# Altium schematic sheet Sheet2.SchDoc
size A4
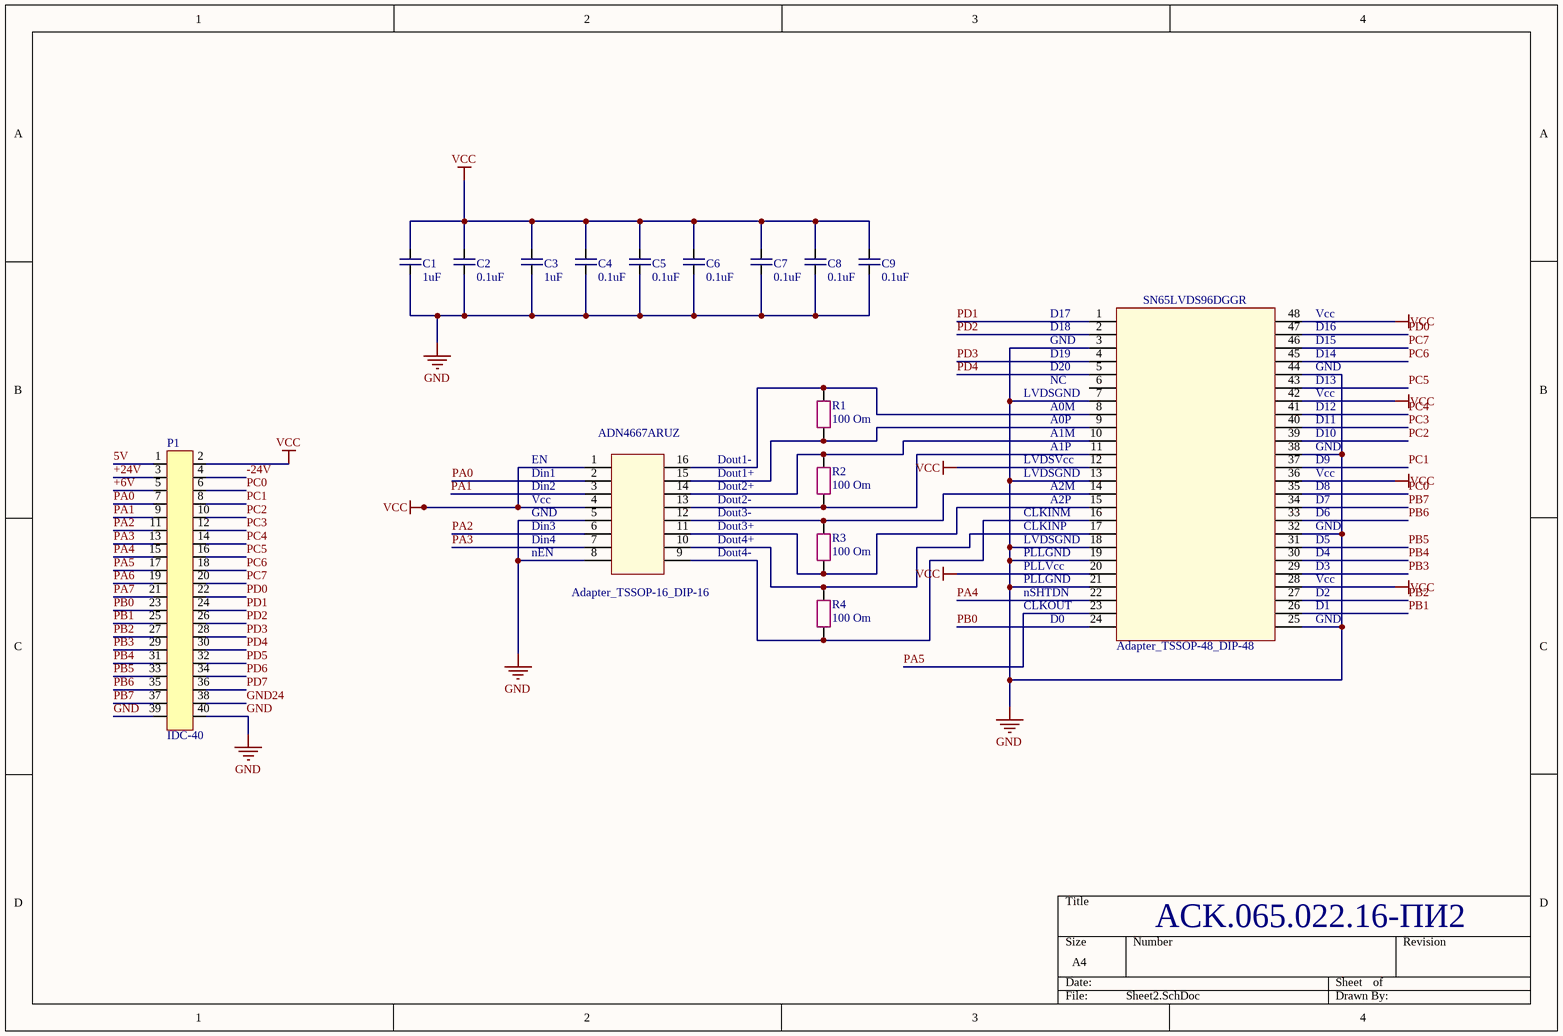
[diagram p0: Sheet2.SchDoc]

## Parts
ADN4667ARUZ  Adapter_TSSOP-16_DIP-16  [Adapter_TSSOP-16_DIP-16]
C1  1uF  [C_0805]
C2  0.1uF  [C_0805]
C3  1uF  [C_0805]
C4  0.1uF  [C_0805]
C5  0.1uF  [C_0805]
C6  0.1uF  [C_0805]
C7  0.1uF  [C_0805]
C8  0.1uF  [C_0805]
C9  0.1uF  [C_0805]
P1  IDC-40  [IDC-40]
R1  100 Om  [R_0805]
R2  100 Om  [R_0805]
R3  100 Om  [R_0805]
R4  100 Om  [R_0805]
SN65LVDS96DGGR  Adapter_TSSOP-48_DIP-48  [Adapter_TSSOP-48_DIP-48]

## Nets
GND: ADN4667ARUZ.5 ADN4667ARUZ.8 C1.2 C2.2 C3.2 C4.2 C5.2 C6.2 C7.2 C8.2 C9.2 P1.39 P1.40 SN65LVDS96DGGR.3 SN65LVDS96DGGR.7 SN65LVDS96DGGR.13 SN65LVDS96DGGR.18 SN65LVDS96DGGR.19 SN65LVDS96DGGR.21 SN65LVDS96DGGR.25 SN65LVDS96DGGR.32 SN65LVDS96DGGR.38 SN65LVDS96DGGR.44
VCC: ADN4667ARUZ.1 ADN4667ARUZ.4 C1.1 C2.1 C3.1 C4.1 C5.1 C6.1 C7.1 C8.1 C9.1 P1.2 SN65LVDS96DGGR.12 SN65LVDS96DGGR.20 SN65LVDS96DGGR.28 SN65LVDS96DGGR.36 SN65LVDS96DGGR.42 SN65LVDS96DGGR.48
5V: P1.1
+6V: P1.5
+24V: P1.3
-24V: P1.4
GND24: P1.38
PA0: ADN4667ARUZ.2 P1.7
PA1: ADN4667ARUZ.3 P1.9
PA2: ADN4667ARUZ.6 P1.11
PA3: ADN4667ARUZ.7 P1.13
PA4: P1.15 SN65LVDS96DGGR.22
PA5: P1.17 SN65LVDS96DGGR.23
PA6: P1.19
PA7: P1.21
PB0: P1.23 SN65LVDS96DGGR.24
PB1: P1.25 SN65LVDS96DGGR.26
PB2: P1.27 SN65LVDS96DGGR.27
PB3: P1.29 SN65LVDS96DGGR.29
PB4: P1.31 SN65LVDS96DGGR.30
PB5: P1.33 SN65LVDS96DGGR.31
PB6: P1.35 SN65LVDS96DGGR.33
PB7: P1.37 SN65LVDS96DGGR.34
PC0: P1.6 SN65LVDS96DGGR.35
PC1: P1.8 SN65LVDS96DGGR.37
PC2: P1.10 SN65LVDS96DGGR.39
PC3: P1.12 SN65LVDS96DGGR.40
PC4: P1.14 SN65LVDS96DGGR.41
PC5: P1.16 SN65LVDS96DGGR.43
PC6: P1.18 SN65LVDS96DGGR.45
PC7: P1.20 SN65LVDS96DGGR.46
PD0: P1.22 SN65LVDS96DGGR.47
PD1: P1.24 SN65LVDS96DGGR.1
PD2: P1.26 SN65LVDS96DGGR.2
PD3: P1.28 SN65LVDS96DGGR.4
PD4: P1.30 SN65LVDS96DGGR.5
PD5: P1.32
PD6: P1.34
PD7: P1.36
NetADN4667ARUZ_9: ADN4667ARUZ.9 R4.1 SN65LVDS96DGGR.16
NetADN4667ARUZ_10: ADN4667ARUZ.10 R4.2 SN65LVDS96DGGR.17
NetADN4667ARUZ_11: ADN4667ARUZ.11 R3.1 SN65LVDS96DGGR.15
NetADN4667ARUZ_12: ADN4667ARUZ.12 R3.2 SN65LVDS96DGGR.14
NetADN4667ARUZ_13: ADN4667ARUZ.13 R2.1 SN65LVDS96DGGR.11
NetADN4667ARUZ_14: ADN4667ARUZ.14 R2.2 SN65LVDS96DGGR.10
NetADN4667ARUZ_15: ADN4667ARUZ.15 R1.1 SN65LVDS96DGGR.9
NetADN4667ARUZ_16: ADN4667ARUZ.16 R1.2 SN65LVDS96DGGR.8

Not connected (* = marked no-connect by the designer): SN65LVDS96DGGR 6

## Notes on the sheet
- (near SN65LVDS96DGGR) D17
- (near SN65LVDS96DGGR) Vcc
- (near SN65LVDS96DGGR) D18
- (near SN65LVDS96DGGR) D19
- (near SN65LVDS96DGGR) D20
- (near SN65LVDS96DGGR) GND
- NC
- (near SN65LVDS96DGGR) D13
- (near SN65LVDS96DGGR) D14
- (near SN65LVDS96DGGR) D15
- (near SN65LVDS96DGGR) D16
- (near SN65LVDS96DGGR) LVDSGND
- (near SN65LVDS96DGGR) A1P
- (near SN65LVDS96DGGR) A1M
- (near SN65LVDS96DGGR) A0P
- (near SN65LVDS96DGGR) A0M
- (near SN65LVDS96DGGR) D10
- (near SN65LVDS96DGGR) D11
- (near SN65LVDS96DGGR) D12
- EN
- Din1
- Din2
- Vcc
- GND
- Dout1-
- Dout2-
- Dout3-
- Dout2+
- Dout1+
- (near SN65LVDS96DGGR) LVDSVcc
- CLKINM
- (near SN65LVDS96DGGR) A2P
- (near SN65LVDS96DGGR) A2M
- (near SN65LVDS96DGGR) D6
- (near SN65LVDS96DGGR) D7
- (near SN65LVDS96DGGR) D8
- (near SN65LVDS96DGGR) D9
- Din3
- Din4
- nEN
- Dout4-
- Dout4+
- Dout3+
- PLLGND
- PLLVcc
- CLKINP
- (near SN65LVDS96DGGR) D3
- (near SN65LVDS96DGGR) D4
- (near SN65LVDS96DGGR) D5
- nSHTDN
- CLKOUT
- D0
- (near SN65LVDS96DGGR) D1
- (near SN65LVDS96DGGR) D2
- ACK.065.022.16-ПИ2

## Library data of the parts
C1-C9 = capacitor 0805
P1 = IDC-40: разъем 2529
R1-R4 = resistor 0805